# Altium project PCB_Project.PrjPcb
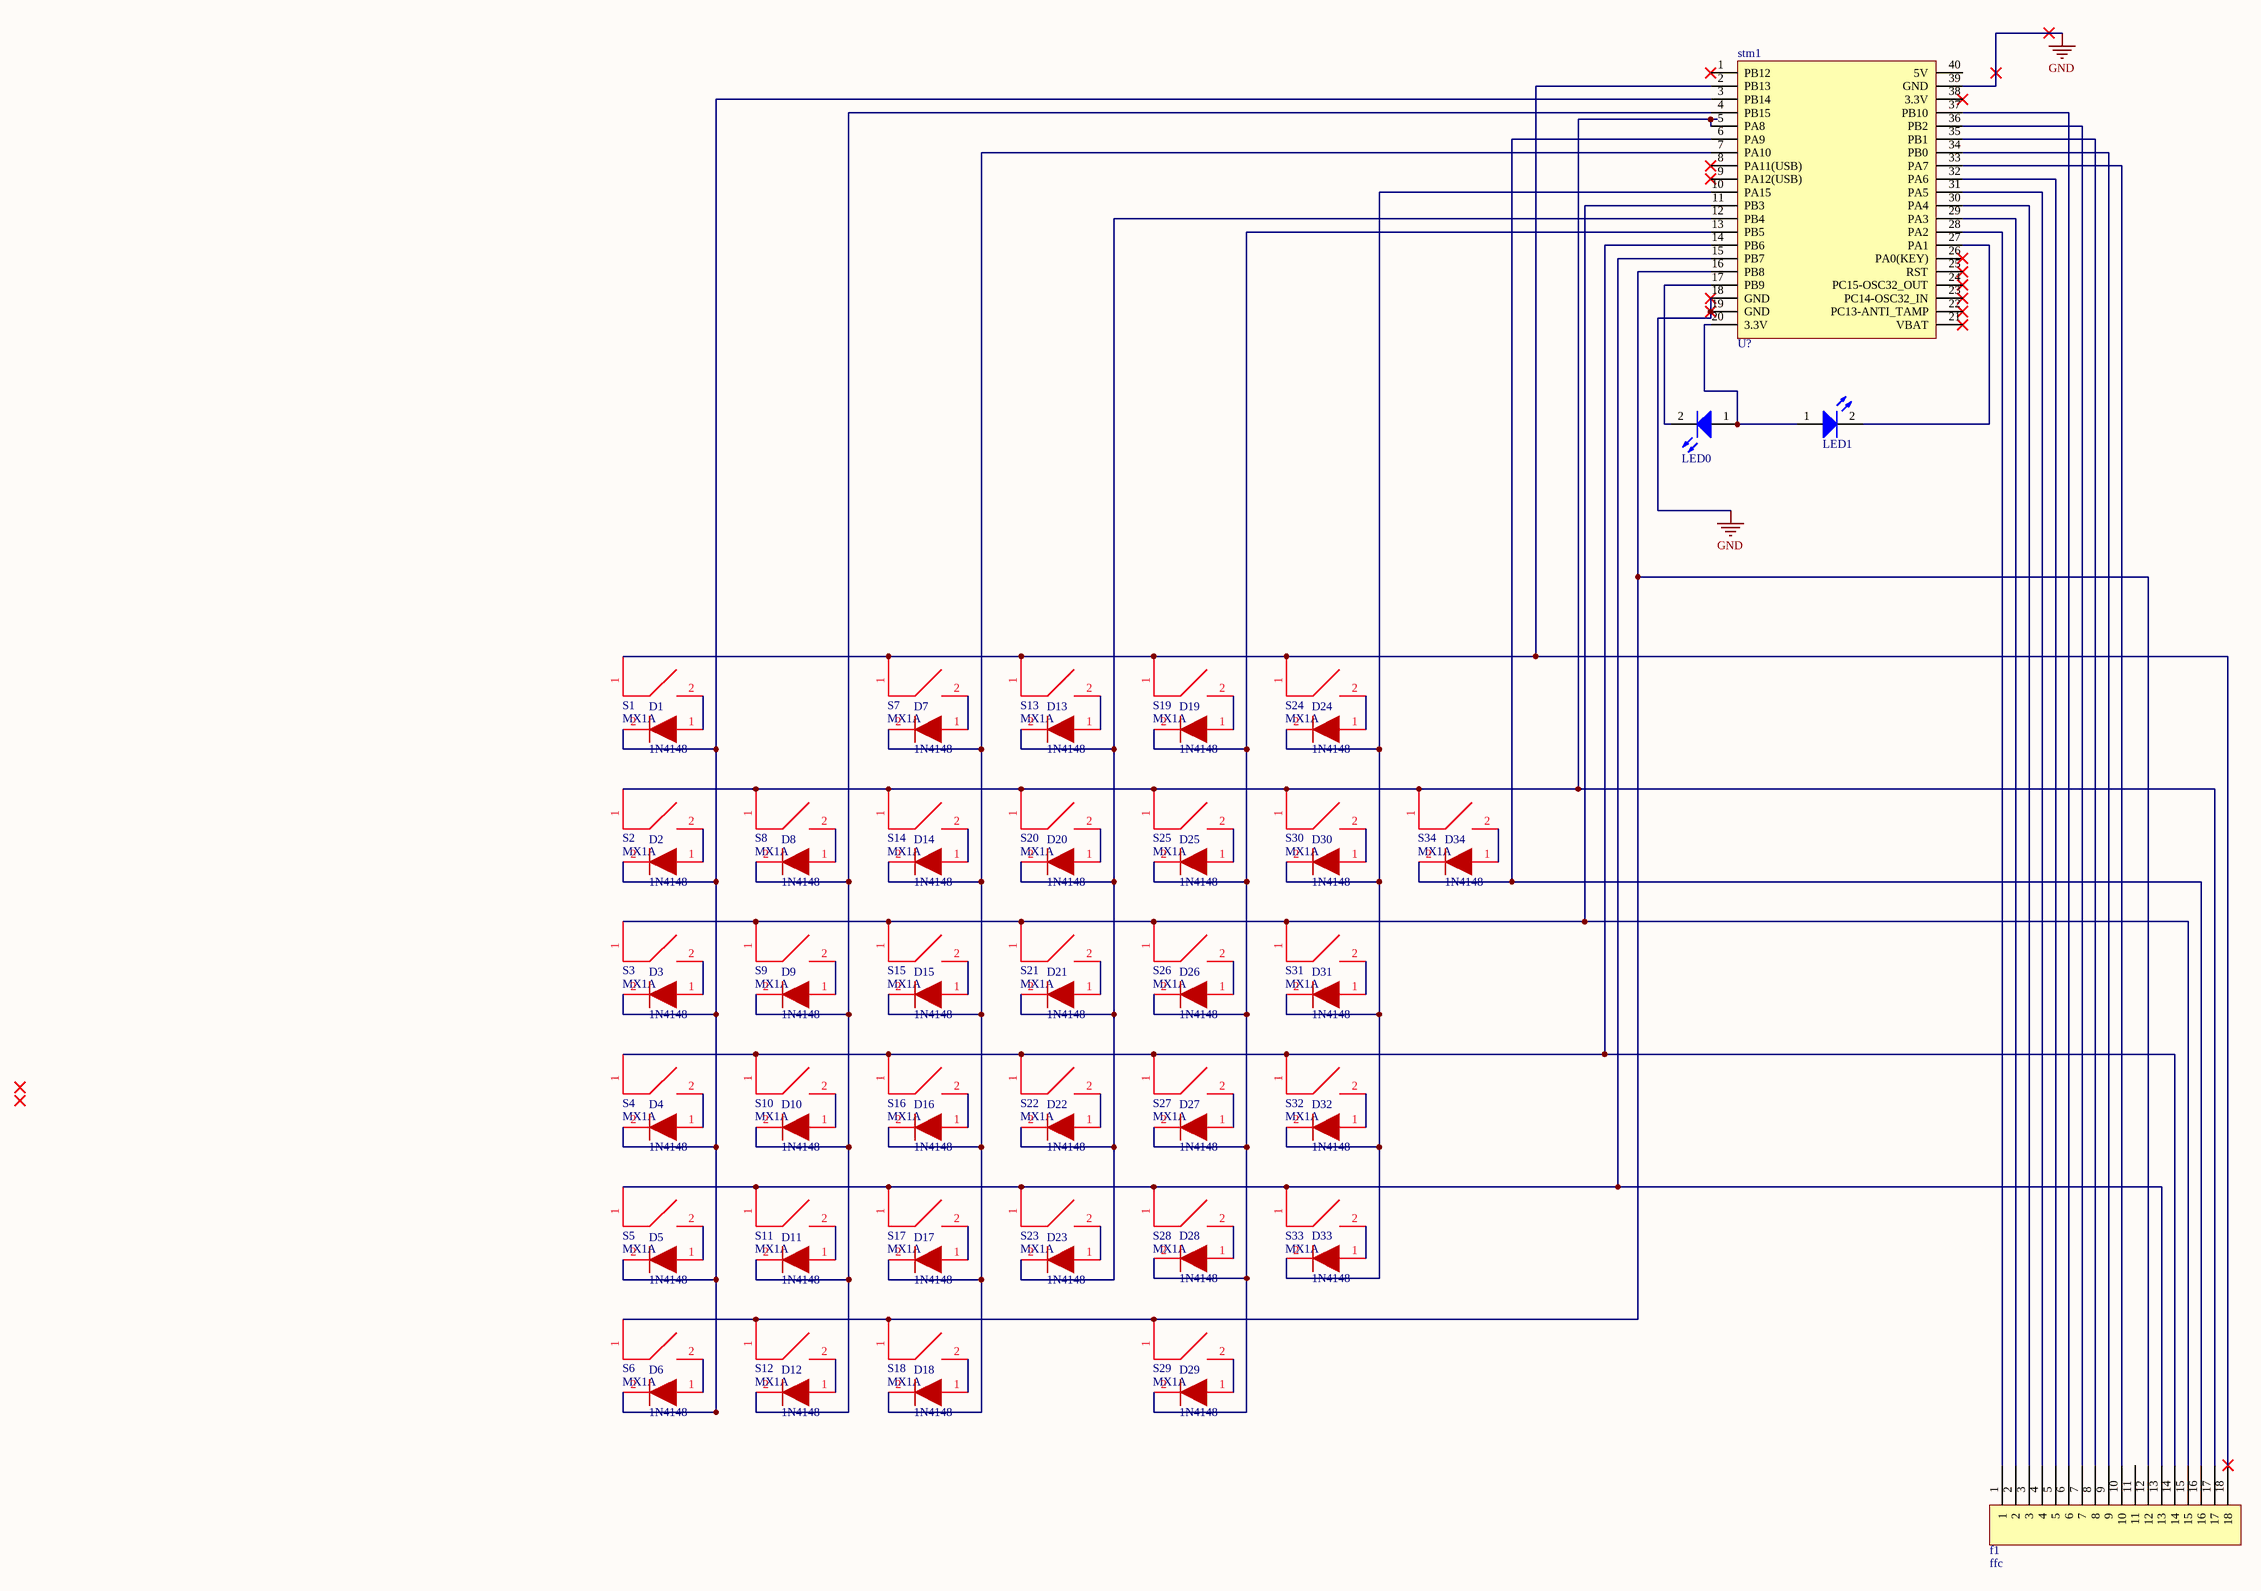
[diagram p0: Matrix.SchDoc]
2 sheets, 181 parts. Net scope: global (net labels, ports and power ports of the same name join across sheets).
Board file: keypboard_v2.PcbDoc
Sheets:
  Matrix.SchDoc
  Sheet1.SchDoc

## Sheet Matrix.SchDoc
size A1

### Parts
D1  1N4148  [SOD323]
D2  1N4148  [SOD323]
D3  1N4148  [SOD323]
D4  1N4148  [SOD323]
D5  1N4148  [SOD323]
D6  1N4148  [SOD323]
D7  1N4148  [SOD323]
D8  1N4148  [SOD323]
D9  1N4148  [SOD323]
D10  1N4148  [SOD323]
D11  1N4148  [SOD323]
D12  1N4148  [SOD323]
D13  1N4148  [SOD323]
D14  1N4148  [SOD323]
D15  1N4148  [SOD323]
D16  1N4148  [SOD323]
D17  1N4148  [SOD323]
D18  1N4148  [SOD323]
D19  1N4148  [SOD323]
D20  1N4148  [SOD323]
D21  1N4148  [SOD323]
D22  1N4148  [SOD323]
D23  1N4148  [SOD323]
D24  1N4148  [SOD323]
D25  1N4148  [SOD323]
D26  1N4148  [SOD323]
D27  1N4148  [SOD323]
D28  1N4148  [SOD323]
D29  1N4148  [SOD323]
D30  1N4148  [SOD323]
D31  1N4148  [SOD323]
D32  1N4148  [SOD323]
D33  1N4148  [SOD323]
D34  1N4148  [SOD323]
D35  LED0  [LED]
D36  LED1  [LED]
f1  ffc  [FFC]
S1  MX1A  [KEY]
S2  MX1A  [KEY]
S3  MX1A  [KEY]
S4  MX1A  [KEY]
S5  MX1A  [KEY]
S6  MX1A  [KEY]
S7  MX1A  [KEY]
S8  MX1A  [KEY]
S9  MX1A  [KEY]
S10  MX1A  [KEY]
S11  MX1A  [KEY]
S12  MX1A  [KEY]
S13  MX1A  [KEY]
S14  MX1A  [KEY]
S15  MX1A  [KEY]
S16  MX1A  [KEY]
S17  MX1A  [KEY]
S18  MX1A  [KEY]
S19  MX1A  [KEY]
S20  MX1A  [KEY]
S21  MX1A  [KEY]
S22  MX1A  [KEY]
S23  MX1A  [KEY]
S24  MX1A  [KEY]
S25  MX1A  [KEY]
S26  MX1A  [KEY]
S27  MX1A  [KEY]
S28  MX1A  [KEY]
S29  MX1A  [KEY]
S30  MX1A  [KEY]
S31  MX1A  [KEY]
S32  MX1A  [KEY]
S33  MX1A  [KEY]
S34  MX1A  [KEY]
stm1  U?  [stm32f4x1cxu6_core]

### Nets
GND: stm1.18(GND) stm1.19(GND) stm1.39(GND)
NetD1_1: D1.1 S1.2
NetD1_2: D1.2 D2.2 D3.2 D4.2 D5.2 D6.2 stm1.3(PB14)
NetD2_1: D2.1 S2.2
NetD3_1: D3.1 S3.2
NetD4_1: D4.1 S4.2
NetD5_1: D5.1 S5.2
NetD6_1: D6.1 S6.2
NetD7_1: D7.1 S7.2
NetD7_2: D7.2 D14.2 D15.2 D16.2 D17.2 D18.2 stm1.7(PA10)
NetD8_1: D8.1 S8.2
NetD8_2: D8.2 D9.2 D10.2 D11.2 D12.2 stm1.4(PB15)
NetD9_1: D9.1 S9.2
NetD10_1: D10.1 S10.2
NetD11_1: D11.1 S11.2
NetD12_1: D12.1 S12.2
NetD13_1: D13.1 S13.2
NetD13_2: D13.2 D20.2 D21.2 D22.2 D23.2 stm1.12(PB4)
NetD14_1: D14.1 S14.2
NetD15_1: D15.1 S15.2
NetD16_1: D16.1 S16.2
NetD17_1: D17.1 S17.2
NetD18_1: D18.1 S18.2
NetD19_1: D19.1 S19.2
NetD19_2: D19.2 D25.2 D26.2 D27.2 D28.2 D29.2 stm1.13(PB5)
NetD20_1: D20.1 S20.2
NetD21_1: D21.1 S21.2
NetD22_1: D22.1 S22.2
NetD23_1: D23.1 S23.2
NetD24_1: D24.1 S24.2
NetD24_2: D24.2 D30.2 D31.2 D32.2 D33.2 stm1.10(PA15)
NetD25_1: D25.1 S25.2
NetD26_1: D26.1 S26.2
NetD27_1: D27.1 S27.2
NetD28_1: D28.1 S28.2
NetD29_1: D29.1 S29.2
NetD30_1: D30.1 S30.2
NetD31_1: D31.1 S31.2
NetD32_1: D32.1 S32.2
NetD33_1: D33.1 S33.2
NetD34_1: D34.1 S34.2
NetD34_2: D34.2 f1.16 stm1.6(PA9)
NetD35_1: D35.1(A) D36.1(A) stm1.20(3.3V)
NetD35_2: D35.2(K) stm1.17(PB9)
NetD36_2: D36.2(K) stm1.27(PA1)
Netf1_1: f1.1 stm1.28(PA2)
Netf1_2: f1.2 stm1.29(PA3)
Netf1_3: f1.3 stm1.30(PA4)
Netf1_4: f1.4 stm1.31(PA5)
Netf1_5: f1.5 stm1.32(PA6)
Netf1_6: f1.6 stm1.37(PB10)
Netf1_7: f1.7 stm1.36(PB2)
Netf1_8: f1.8 stm1.35(PB1)
Netf1_9: f1.9 stm1.34(PB0)
Netf1_10: f1.10 stm1.33(PA7)
Netf1_12: f1.12 S6.1 S12.1 S18.1 S29.1 stm1.16(PB8)
Netf1_13: f1.13 S5.1 S11.1 S17.1 S23.1 S28.1 S33.1 stm1.15(PB7)
Netf1_14: f1.14 S4.1 S10.1 S16.1 S22.1 S27.1 S32.1 stm1.14(PB6)
Netf1_15: f1.15 S3.1 S9.1 S15.1 S21.1 S26.1 S31.1 stm1.11(PB3)
Netf1_17: f1.17 S2.1 S8.1 S14.1 S20.1 S25.1 S30.1 S34.1 stm1.5(PA8)
Netf1_18: f1.18 S1.1 S7.1 S13.1 S19.1 S24.1 stm1.2(PB13)

Not connected (* = marked no-connect by the designer): f1 11; stm1 1(PB12)* 8(PA11(USB))* 9(PA12(USB))* 21(VBAT)* 22(PC13-ANTI_TAMP)* 23(PC14-OSC32_IN)* 24(PC15-OSC32_OUT)* 25(RST)* 26(PA0(KEY))* 38(3.3V)* 40(5V)

### Library data of the parts
D1-D34 = 1N4148: 二极管
D35 D36 = LED0: Typical INFRARED GaAs LED; Published: 8-Jun-2000; LatestRevisionDate: 08-Jul-2005; LatestRevisionNote: Mech Layer 1 removed.; PackageReference: LED-0; Publisher: Altium Limited; PackageDescription: LED; 2 Leads
S1-S34 = MX1A: 按键
stm1 = stm32f4x1cxu6_core

## Sheet Sheet1.SchDoc
size A1
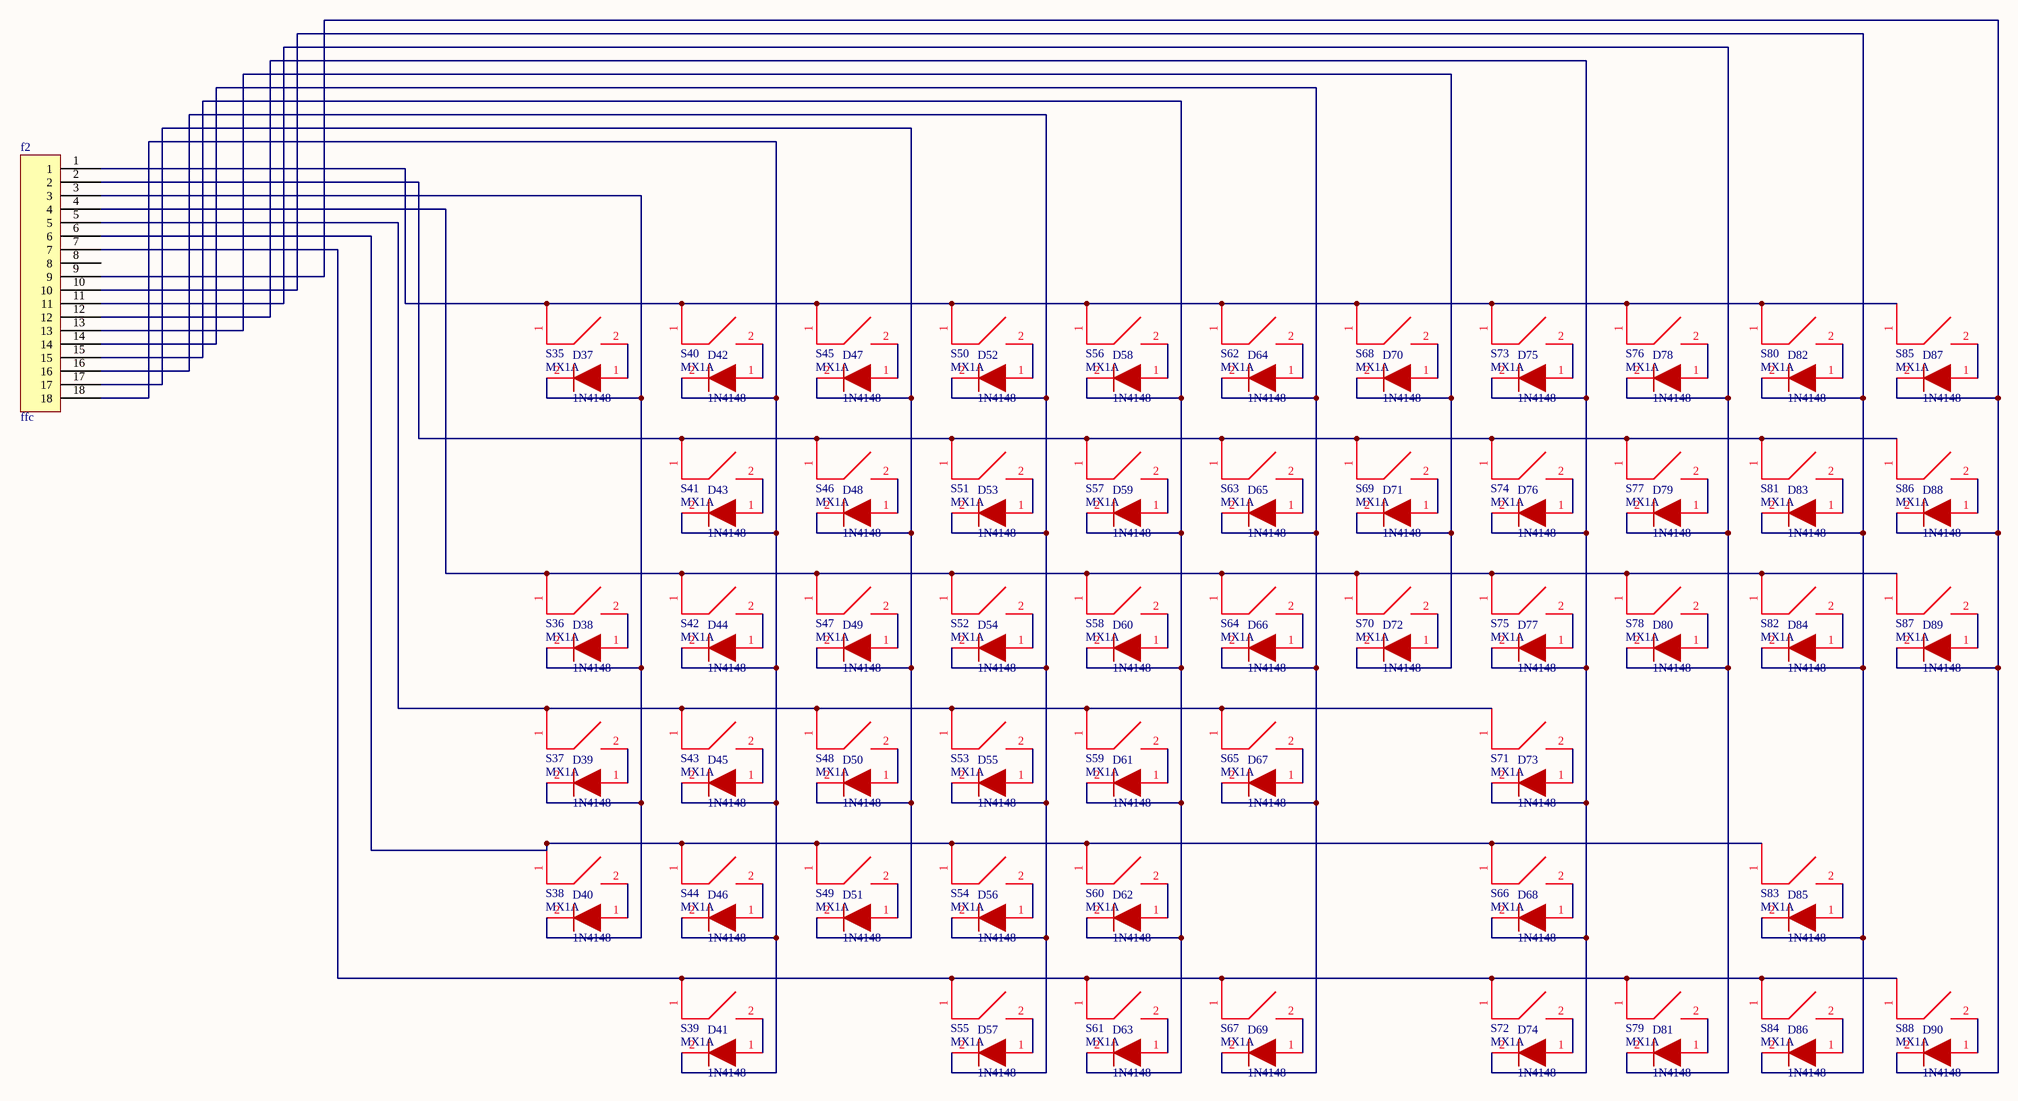
[diagram p1: Sheet1.SchDoc]

### Parts
D37  1N4148  [SOD323]
D38  1N4148  [SOD323]
D39  1N4148  [SOD323]
D40  1N4148  [SOD323]
D41  1N4148  [SOD323]
D42  1N4148  [SOD323]
D43  1N4148  [SOD323]
D44  1N4148  [SOD323]
D45  1N4148  [SOD323]
D46  1N4148  [SOD323]
D47  1N4148  [SOD323]
D48  1N4148  [SOD323]
D49  1N4148  [SOD323]
D50  1N4148  [SOD323]
D51  1N4148  [SOD323]
D52  1N4148  [SOD323]
D53  1N4148  [SOD323]
D54  1N4148  [SOD323]
D55  1N4148  [SOD323]
D56  1N4148  [SOD323]
D57  1N4148  [SOD323]
D58  1N4148  [SOD323]
D59  1N4148  [SOD323]
D60  1N4148  [SOD323]
D61  1N4148  [SOD323]
D62  1N4148  [SOD323]
D63  1N4148  [SOD323]
D64  1N4148  [SOD323]
D65  1N4148  [SOD323]
D66  1N4148  [SOD323]
D67  1N4148  [SOD323]
D68  1N4148  [SOD323]
D69  1N4148  [SOD323]
D70  1N4148  [SOD323]
D71  1N4148  [SOD323]
D72  1N4148  [SOD323]
D73  1N4148  [SOD323]
D74  1N4148  [SOD323]
D75  1N4148  [SOD323]
D76  1N4148  [SOD323]
D77  1N4148  [SOD323]
D78  1N4148  [SOD323]
D79  1N4148  [SOD323]
D80  1N4148  [SOD323]
D81  1N4148  [SOD323]
D82  1N4148  [SOD323]
D83  1N4148  [SOD323]
D84  1N4148  [SOD323]
D85  1N4148  [SOD323]
D86  1N4148  [SOD323]
D87  1N4148  [SOD323]
D88  1N4148  [SOD323]
D89  1N4148  [SOD323]
D90  1N4148  [SOD323]
f2  ffc  [FFC]
S35  MX1A  [KEY]
S36  MX1A  [KEY]
S37  MX1A  [KEY]
S38  MX1A  [KEY]
S39  MX1A  [KEY]
S40  MX1A  [KEY]
S41  MX1A  [KEY]
S42  MX1A  [KEY]
S43  MX1A  [KEY]
S44  MX1A  [KEY]
S45  MX1A  [KEY]
S46  MX1A  [KEY]
S47  MX1A  [KEY]
S48  MX1A  [KEY]
S49  MX1A  [KEY]
S50  MX1A  [KEY]
S51  MX1A  [KEY]
S52  MX1A  [KEY]
S53  MX1A  [KEY]
S54  MX1A  [KEY]
S55  MX1A  [KEY]
S56  MX1A  [KEY]
S57  MX1A  [KEY]
S58  MX1A  [KEY]
S59  MX1A  [KEY]
S60  MX1A  [KEY]
S61  MX1A  [KEY]
S62  MX1A  [KEY]
S63  MX1A  [KEY]
S64  MX1A  [KEY]
S65  MX1A  [KEY]
S66  MX1A  [KEY]
S67  MX1A  [KEY]
S68  MX1A  [KEY]
S69  MX1A  [KEY]
S70  MX1A  [KEY]
S71  MX1A  [KEY]
S72  MX1A  [KEY]
S73  MX1A  [KEY]
S74  MX1A  [KEY]
S75  MX1A  [KEY]
S76  MX1A  [KEY]
S77  MX1A  [KEY]
S78  MX1A  [KEY]
S79  MX1A  [KEY]
S80  MX1A  [KEY]
S81  MX1A  [KEY]
S82  MX1A  [KEY]
S83  MX1A  [KEY]
S84  MX1A  [KEY]
S85  MX1A  [KEY]
S86  MX1A  [KEY]
S87  MX1A  [KEY]
S88  MX1A  [KEY]

### Nets
NetD37_1: D37.1 S35.2
NetD37_2: D37.2 D38.2 D39.2 D40.2 f2.3
NetD38_1: D38.1 S36.2
NetD39_1: D39.1 S37.2
NetD40_1: D40.1 S38.2
NetD41_1: D41.1 S39.2
NetD41_2: D41.2 D42.2 D43.2 D44.2 D45.2 D46.2 f2.18
NetD42_1: D42.1 S40.2
NetD43_1: D43.1 S41.2
NetD44_1: D44.1 S42.2
NetD45_1: D45.1 S43.2
NetD46_1: D46.1 S44.2
NetD47_1: D47.1 S45.2
NetD47_2: D47.2 D48.2 D49.2 D50.2 D51.2 f2.17
NetD48_1: D48.1 S46.2
NetD49_1: D49.1 S47.2
NetD50_1: D50.1 S48.2
NetD51_1: D51.1 S49.2
NetD52_1: D52.1 S50.2
NetD52_2: D52.2 D53.2 D54.2 D55.2 D56.2 D57.2 f2.16
NetD53_1: D53.1 S51.2
NetD54_1: D54.1 S52.2
NetD55_1: D55.1 S53.2
NetD56_1: D56.1 S54.2
NetD57_1: D57.1 S55.2
NetD58_1: D58.1 S56.2
NetD58_2: D58.2 D59.2 D60.2 D61.2 D62.2 D63.2 f2.15
NetD59_1: D59.1 S57.2
NetD60_1: D60.1 S58.2
NetD61_1: D61.1 S59.2
NetD62_1: D62.1 S60.2
NetD63_1: D63.1 S61.2
NetD64_1: D64.1 S62.2
NetD64_2: D64.2 D65.2 D66.2 D67.2 D69.2 f2.14
NetD65_1: D65.1 S63.2
NetD66_1: D66.1 S64.2
NetD67_1: D67.1 S65.2
NetD68_1: D68.1 S66.2
NetD68_2: D68.2 D73.2 D74.2 D75.2 D76.2 D77.2 f2.12
NetD69_1: D69.1 S67.2
NetD70_1: D70.1 S68.2
NetD70_2: D70.2 D71.2 D72.2 f2.13
NetD71_1: D71.1 S69.2
NetD72_1: D72.1 S70.2
NetD73_1: D73.1 S71.2
NetD74_1: D74.1 S72.2
NetD75_1: D75.1 S73.2
NetD76_1: D76.1 S74.2
NetD77_1: D77.1 S75.2
NetD78_1: D78.1 S76.2
NetD78_2: D78.2 D79.2 D80.2 D81.2 f2.11
NetD79_1: D79.1 S77.2
NetD80_1: D80.1 S78.2
NetD81_1: D81.1 S79.2
NetD82_1: D82.1 S80.2
NetD82_2: D82.2 D83.2 D84.2 D85.2 D86.2 f2.10
NetD83_1: D83.1 S81.2
NetD84_1: D84.1 S82.2
NetD85_1: D85.1 S83.2
NetD86_1: D86.1 S84.2
NetD87_1: D87.1 S85.2
NetD87_2: D87.2 D88.2 D89.2 D90.2 f2.9
NetD88_1: D88.1 S86.2
NetD89_1: D89.1 S87.2
NetD90_1: D90.1 S88.2
Netf2_1: f2.1 S35.1 S40.1 S45.1 S50.1 S56.1 S62.1 S68.1 S73.1 S76.1 S80.1 S85.1
Netf2_2: f2.2 S41.1 S46.1 S51.1 S57.1 S63.1 S69.1 S74.1 S77.1 S81.1 S86.1
Netf2_4: f2.4 S36.1 S42.1 S47.1 S52.1 S58.1 S64.1 S70.1 S75.1 S78.1 S82.1 S87.1
Netf2_5: f2.5 S37.1 S43.1 S48.1 S53.1 S59.1 S65.1 S71.1
Netf2_6: f2.6 S38.1 S44.1 S49.1 S54.1 S60.1 S66.1 S83.1
Netf2_7: f2.7 S39.1 S55.1 S61.1 S67.1 S72.1 S79.1 S84.1 S88.1

Not connected (* = marked no-connect by the designer): f2 8

### Library data of the parts
D37-D90 = 1N4148: 二极管
S35-S88 = MX1A: 按键